# EAGLE design ZigUP (EAGLE 7.7.0)
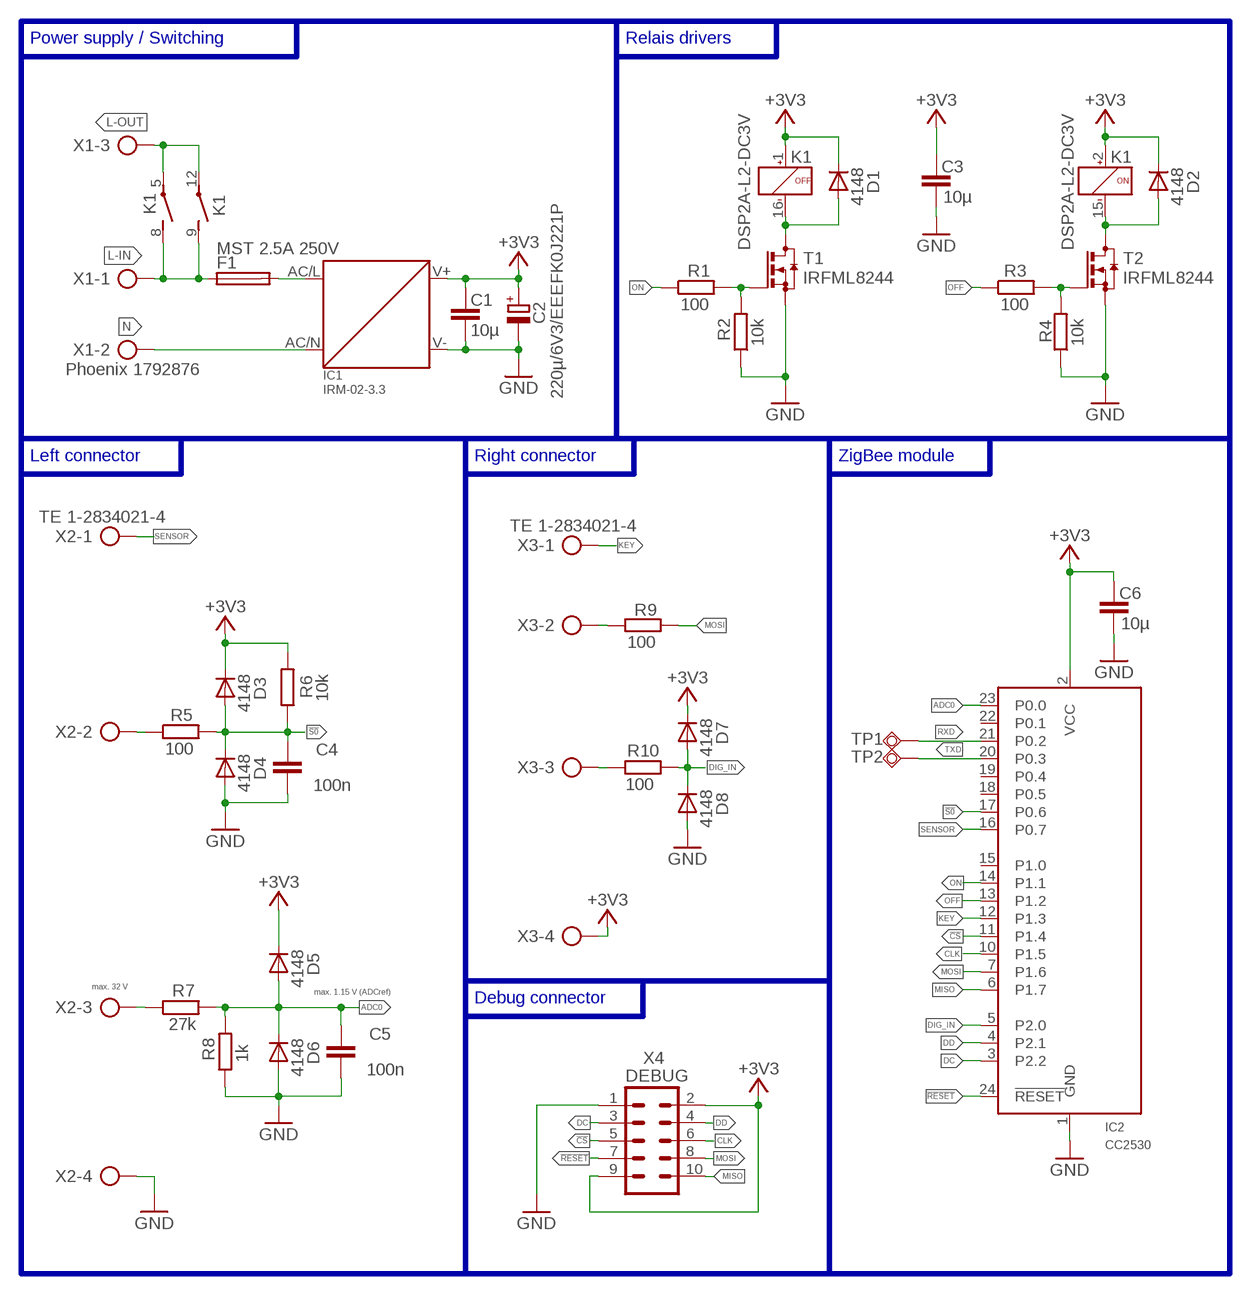
[diagram p0: schematic, sheet 1]

## Parts
C1  10µ  C-EUC0805  [C0805]
C2  220µ/6V3/EEEFK0J221P  CPOL-EUD  [PANASONIC_D]
C3  10µ  C-EUC0805  [C0805]
C4  100n  C-EUC0805  [C0805]
C5  100n  C-EUC0805  [C0805]
C6  10µ  C-EUC0805  [C0805]
D1  4148  TS4148  [1206]
D2  4148  TS4148  [1206]
D3  4148  TS4148  [1206]
D4  4148  TS4148  [1206]
D5  4148  TS4148  [1206]
D6  4148  TS4148  [1206]
D7  4148  TS4148  [1206]
D8  4148  TS4148  [1206]
F1  MST 2.5A 250V  MST  [MST]
IC1  IRM-02-3.3  IRM-01  [IRM-01]
IC2  CC2530  CC2530THT  [E18-MS1-PCB]
K1  DSP2A-L2-DC3V  DSP2A-L2  [DSP2A-L2]
R1  100  R-EU_R0805  [R0805]
R2  10k  R-EU_R0805  [R0805]
R3  100  R-EU_R0805  [R0805]
R4  10k  R-EU_R0805  [R0805]
R5  100  R-EU_R0805  [R0805]
R6  10k  R-EU_R0805  [R0805]
R7  27k  R-EU_R0805  [R0805]
R8  1k  R-EU_R0805  [R0805]
R9  100  R-EU_R0805  [R0805]
R10  100  R-EU_R0805  [R0805]
T1  IRFML8244  BSS123  [SOT23]
T2  IRFML8244  BSS123  [SOT23]
TP1  RX  TPSQTP15SQ  [TP15SQ]
TP2  TX  TPSQTP15SQ  [TP15SQ]
X1  Phoenix 1792876  PTS3  [PTS-3]
X2  TE 1-2834021-4  MSC4  [MSC4]
X3  TE 1-2834021-4  MSC4  [MSC4]
X4  DEBUG  MA05-2  [MA05-2]

## Nets
!CS: IC2.11(P1.4) X4.5
!RESET: IC2.24(!RESET) X4.7
!S0: C4.1 D3.A D4.K IC2.17(P0.6) R5.2 R6.1
+3V3: C1.1 C2.+ C3.1 C6.1 D1.K D2.K D3.K D5.K D7.K IC1.V+ IC2.2(VCC) K1.1(OFF:+) K1.2(ON:+) R6.2 X3.4 X4.2 X4.9
ADC0: C5.1 D5.A D6.K IC2.23(P0.0) R7.2 R8.2
CLK: IC2.10(P1.5) X4.6
DC: IC2.3(P2.2) X4.3
DD: IC2.4(P2.1) X4.4
DIG_IN: D7.A D8.K IC2.5(P2.0) R10.2
GND: C1.2 C2.- C3.2 C4.2 C5.2 C6.2 D4.A D6.A D8.A IC1.V- IC2.1(GND) R2.1 R4.1 R8.1 T1.2(S) T2.2(S) X2.4 X4.1
KEY: IC2.12(P1.3) X3.1
L-FUSED: F1.2 IC1.AC/L
L-IN: F1.1 K1.8(S1:C) K1.9(S2:C) X1.1
L-OUT: K1.5(S1:S) K1.12(S2:S) X1.3
MISO: IC2.6(P1.7) X4.10
MOSI: IC2.7(P1.6) R9.1 X4.8
N: IC1.AC/N X1.2
N$3: R7.1 X2.3
N$4: D2.A K1.15(ON:-) T2.3(D)
N$5: D1.A K1.16(OFF:-) T1.3(D)
N$6: R3.2 R4.2 T2.1(G)
N$7: R1.2 R2.2 T1.1(G)
N$8: R5.1 X2.2
N$10: R9.2 X3.2
N$12: R10.1 X3.3
OFF: IC2.13(P1.2) R3.1
ON: IC2.14(P1.1) R1.1
RXD: IC2.21(P0.2) TP1.TP
SENSOR: IC2.16(P0.7) X2.1
TXD: IC2.20(P0.3) TP2.TP
Unconnected: IC2.15(P1.0) IC2.18(P0.5) IC2.19(P0.4) IC2.22(P0.1)

## Buses
B$1

## Notes on the sheet
- Power supply / Switching | Relais drivers
- Left connector | Right connector | ZigBee module
- max. 32 V
- max. 1.15 V (ADCref)
- Debug connector

## Library data of the parts
C1 C3-C6 = rcl:C-EU: CAPACITOR, European symbol
C2 = rcl:CPOL-EU: POLARIZED CAPACITOR, European symbol
D1-D8 = Diode-1206:TS4148
F1 = Fuse_MST:MST
IC1 = IRM-01:IRM-01
IC2 = CC2530:CC2530
K1 = DSP2A-L2:DSP2A-L2
R1-R10 = rcl:R-EU_: RESISTOR, European symbol
T1 T2 = transistor-small-signal:BSS123: N-CHANNEL MOS FET
TP1 TP2 = testpad:TPSQ: Test pad
X1 = Phoenix_PTS_5mm:PTS
X2 X3 = TE-MSC:MSC
X4 = con-lstb:MA05-2: PIN HEADER; OC_FARNELL: unknown; OC_NEWARK: unknown

## Board
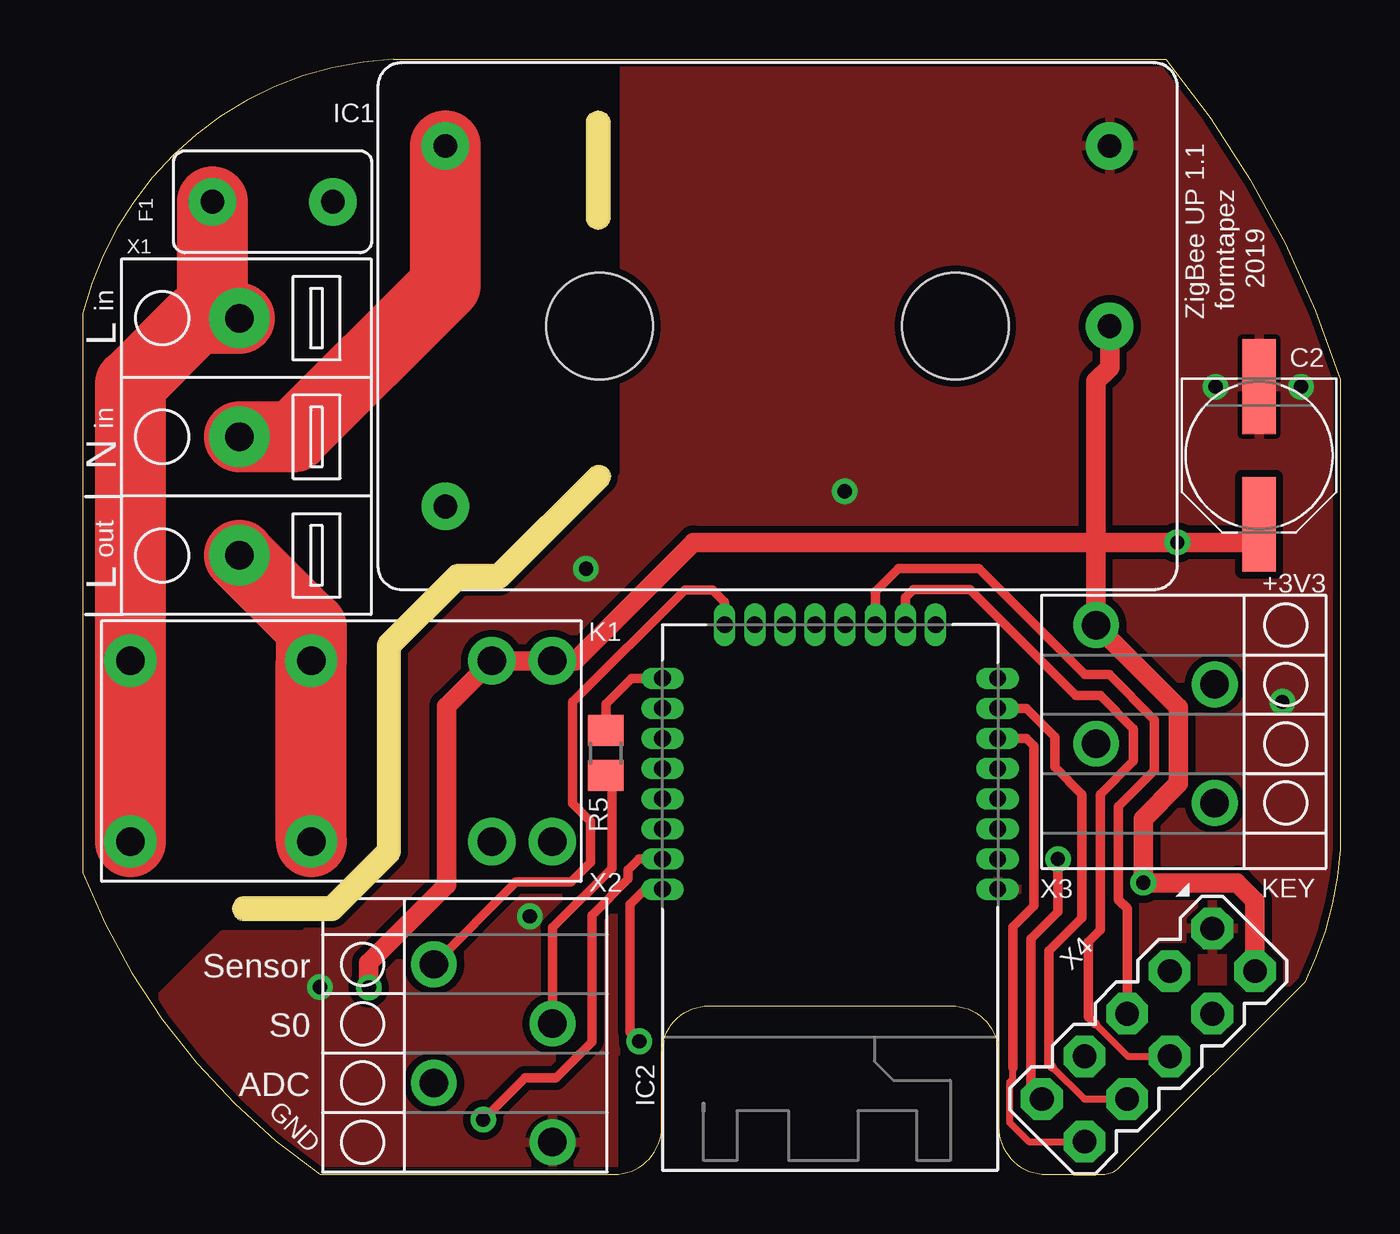
[diagram p1: board, top side]
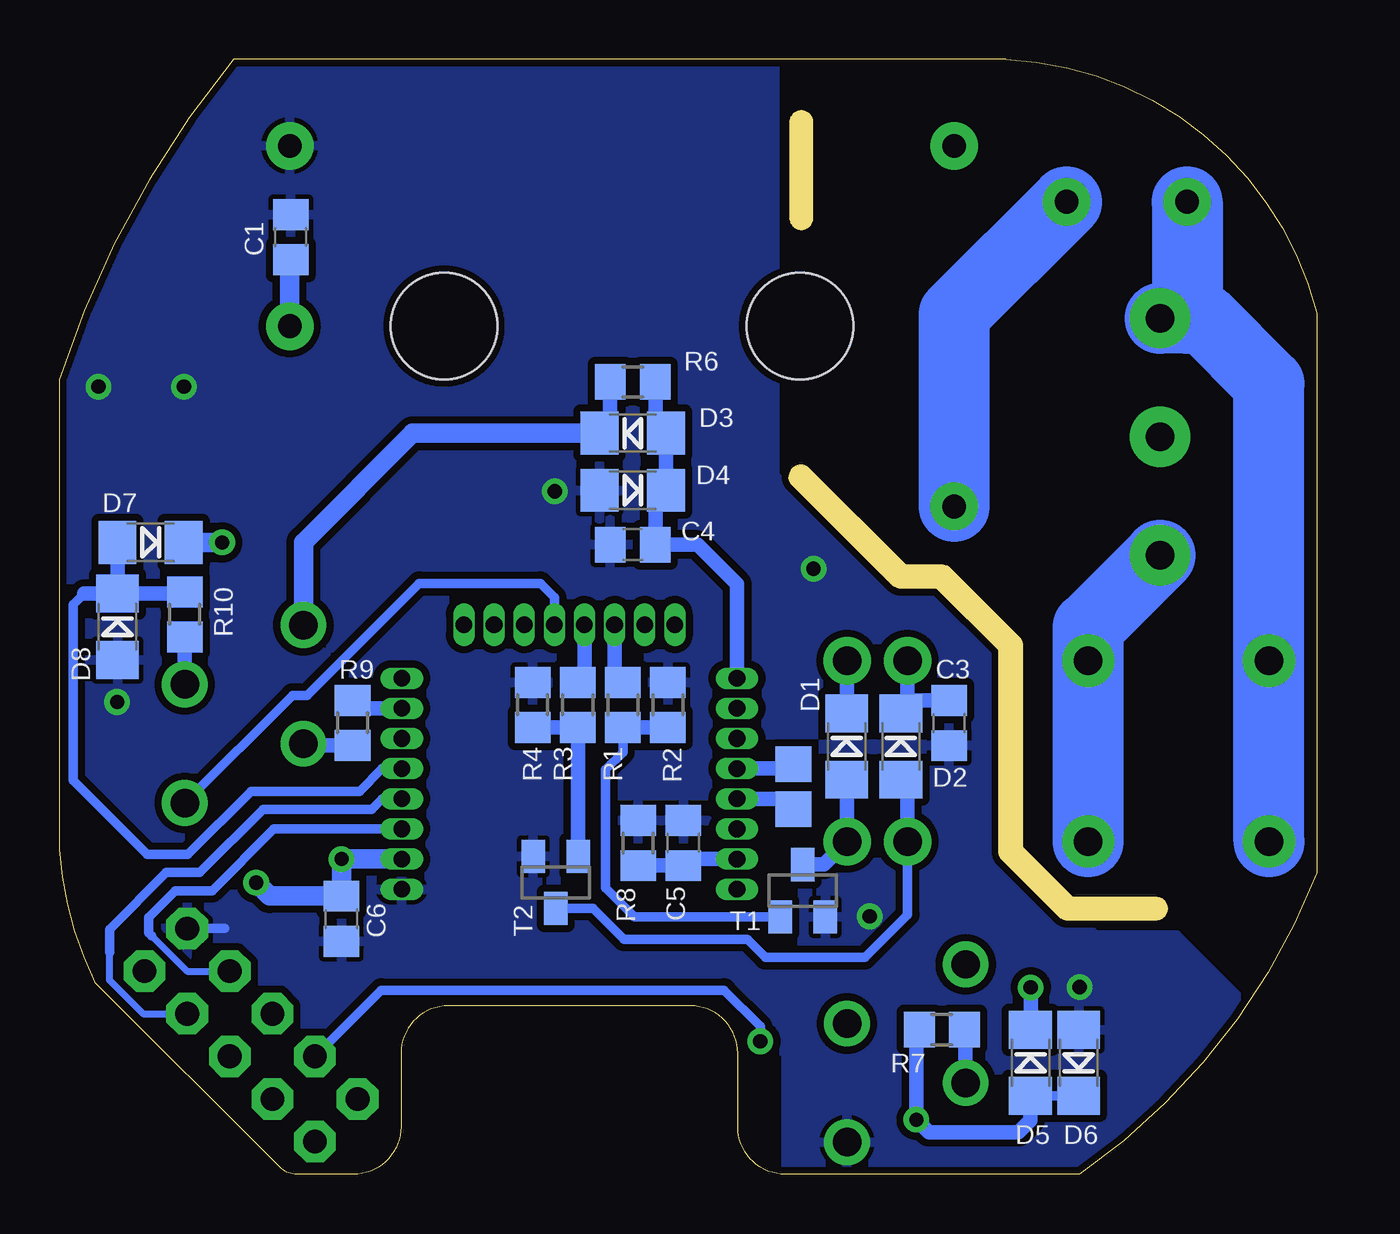
[diagram p2: board, bottom side, seen from below]

Size 53 x 47 mm. Coordinates in mm from the lower left corner, seen from the top.
Outline: 6.8,11.7 arc90 6.3,11.2 arc90 6.8,10.7 10.49,10.7 arc45 10.85,10.85 13.25,13.25 arc45 13.4,13.61 13.4,22.1 16,24.7 17.54,24.7 arc45 17.89,24.85 22.11,29.06 arc45 22.25,29.4 arc45 22.11,29.74 22.09,29.76 arc45 21.75,29.9 arc45 21.41,29.76 17.35,25.7 15.81,25.7 arc45 15.45,25.55 12.55,22.65 arc45 12.4,22.29 12.4,13.8 10.3,11.7 6.8,11.7
Outline: 10,0 22.4,0 arc90 24.4,2 24.4,5.1 arc-90 26.4,7.1 36.6,7.1 arc-90 38.6,5.1 38.6,2 arc90 40.6,0 42.99,0 arc45 43.69,0.29 51.5,8.1 arc23 53,13.7 53,33.5 arc22 45.65,47 13.1,47 arc73 0,36.3 0,12.7 arc34 10,0
Outline: 21.22,44.33 arc-90 21.72,44.83 arc-90 22.22,44.33 22.22,40.33 arc-90 21.72,39.83 arc-90 21.22,40.33 21.22,44.33
Copper layers (1*16): Top 0.035mm / dielectric 1.5mm / Bottom 0.035mm
Design rules "JLCPCB": minimum track width 5mil, minimum drill 0.3mm, track to track 5mil, track to pad 5mil, pad to pad 5mil, via to via 5mil, smd to smd 5mil, copper to edge 0.3mm, drill to drill 0.2mm, minimum pad ring 0.1mm, minimum via ring 0.15mm, stop-mask expansion 0.075mm, vias tented up to drill 0mil, thermal gap 0.2mm
Milling: 7 lines

### Footprints (pad centres in the part's own frame; a part is rotated, then mirrored left to right if it is on the bottom)
C0805 = smd 1.3 x 1.5: 1 -0.95,0; 2 0.95,0
PANASONIC_D = smd 4 x 1.4: + 2.9,0; - -2.9,0
1206 = smd 1.6 x 1.8: A -1.4,0; K 1.4,0
MST = drill 1 pad 2: 1 -2.54,0; 2 2.54,0
IRM-01 = drill 1 pad 2: AC/L -14,-7.6; AC/N -14,7.6; V+ 14,0; V- 14,7.6 | hole 4.5: -7.5,0; 7.5,0
E18-MS1-PCB = drill 0.7 pad 0.9 long: 1 -0.35,7.065; 2 -1.62,7.065; 3 -2.89,7.065; 4 -4.16,7.065; 5 -5.43,7.065; 6 -6.7,7.065; 7 -7.97,7.065; 8 -9.24,7.065; 9 -11.5,4.445; 10 -11.5,3.175; 11 -11.5,1.905; 12 -11.5,0.635; 13 -11.5,-0.635; 14 -11.5,-1.905; 15 -11.5,-3.175; 16 -11.5,-4.445; 17 -9.24,-7.065; 18 -7.97,-7.065; 19 -6.7,-7.065; 20 -5.43,-7.065; 21 -4.16,-7.065; 22 -2.89,-7.065; 23 -1.62,-7.065; 24 -0.35,-7.065
DSP2A-L2 = drill 1.2 pad 2: 1 -8.89,-3.81; 2 -6.35,-3.81; 15 -6.35,3.81; 16 -8.89,3.81 | drill 1.2 pad 2.2: 5 1.27,-3.81; 8 8.89,-3.81; 9 8.89,3.81; 12 1.27,3.81
R0805 = smd 1.3 x 1.5: 1 -0.95,0; 2 0.95,0
SOT23 = smd 1 x 1.4: 1 -0.95,-1.1; 2 0.95,-1.1; 3 0,1.1
TP15SQ = smd 1.5 x 1.5: TP 0,0
PTS-3 = drill 1.2 pad 2.54: 1 -5,0; 2 0,0; 3 5,0
MSC4 = drill 1.2 pad 1.93: 1 -3.75,-2.5; 2 -1.25,2.5; 3 1.25,-2.5; 4 3.75,2.5
MA05-2 = drill 1 pad 1.75 octagon: 1 -5.08,-1.27; 2 -5.08,1.27; 3 -2.54,-1.27; 4 -2.54,1.27; 5 0,-1.27; 6 0,1.27; 7 2.54,-1.27; 8 2.54,1.27; 9 5.08,-1.27; 10 5.08,1.27

### Placement (x,y rotation side)
C1  43.25,39.5 90 bottom
C2  49.58,30.3 270 top
C3  15.5,19.02 270 bottom
C4  28.83,26.54 180 bottom
C5  26.7,13.96 90 bottom
C6  41.1,10.78 270 bottom
D1  19.81,18.03 90 bottom
D2  17.53,18.03 90 bottom
D3  28.83,31.24 180 bottom
D4  28.83,28.83 0 bottom
D5  12.06,4.7 90 bottom
D6  10.03,4.7 270 bottom
D7  49.15,26.64 0 bottom
D8  50.55,23.08 90 bottom
F1  8,41 0 top
IC1  29.29,35.75 0 top
IC2  31.5,11.67 270 top
K1  10.9,17.84 180 top
R1  29.25,19.79 270 bottom
R2  27.35,19.79 270 bottom
R3  31.15,19.79 270 bottom
R4  33.05,19.79 270 bottom
R5  22.05,17.76 90 top
R6  28.83,33.4 180 bottom
R7  15.8,6.1 180 bottom
R8  28.6,13.96 270 bottom
R9  40.64,19.03 270 bottom
R10  47.71,23.6 90 bottom
T1  21.66,11.95 0 bottom
T2  32.08,12.3 180 bottom
TP1  22.05,15.38 0 bottom
TP2  22.05,17.29 0 bottom
X1  6.6,31.09 270 top
X2  17.3,5.1 270 top
X3  45.21,19.4 90 top
X4  44.92,5.87 225 top

### Tracks (layer width: path | path; a pad name or v marks a point on that pad's centre or on a via)
!CS
  Top 0.406: X4.5 44.02,11.2 43.65,11.57 43.65,15.51 45.17,17.03 45.17,19.16 43.26,21.06 42.25,21.06 37.77,25.54 34.37,25.54 33.41,24.57 IC2.11
!RESET  (via drill 0.6)
  Top 0.406: v23.45,5.6 23.07,5.99 23.07,11.39 23.7,12.02 IC2.24
  Bottom 0.406: X4.7 39.43,7.76 24.98,7.76 23.45,6.24 v23.45,5.6
!S0
  Top 0.406: IC2.17 23.14,20.91 22.05,19.82 R5.2
  Bottom 0.406: D4.K 27.88,28.38 | 27.88,31.69 D3.A
  Bottom 0.61: IC2.17 24.43,24.88 26.1,26.54 C4.1 27.88,28.38 | R6.1 27.88,31.69 | D3.A D4.K
+3V3  (via drill 0.6)
  Top 0.406: X4.9 39.96,3.64 39.96,9.92 41.1,11.06 v41.1,13.29
  Top 0.813: X4.2 49.41,11.53 48.64,12.29 v44.7,12.29 44.7,14.98 46.19,16.47 46.19,19.68 X3.4 42.71,26.67 | v12.05,7.88 12.05,8.92 15.33,12.19 15.33,19.73 K1.2 K1.1 20.76,21.65 25.75,26.64 42.64,26.64 42.67,26.67 42.76,26.67 42.8,26.64 | 42.8,26.64 v46.14,26.64 49.58,26.64 C2.+ | 42.8,26.64 42.75,26.64 42.71,26.67 | 42.71,26.67 42.71,33.44 43.29,34.02 IC1.V+
  Bottom 0.406: 19.79,19.46 D1.K | 17.25,19.71 D2.K | 29.78,31.69 D3.K | D5.K
  Bottom 0.61: K1.1 19.79,19.46 | K1.2 17.25,19.71 16.99,19.97 C3.1 | R6.2 29.78,31.69 | v12.05,7.88 D5.K
  Bottom 0.813: X3.4 42.71,26.64 38.1,31.24 D3.K | IC2.2 v41.1,13.29 C6.1 44.14,11.73 v44.7,12.29 | D7.K v46.14,26.64 | IC1.V+ 43.29,38.51 C1.1
ADC0  (via drill 0.6)
  Top 0.406: v16.88,2.3 18.64,4.06 19.94,4.06 21.46,5.59 21.46,10.92 22.99,12.45 22.99,12.83 23.45,13.29 IC2.23
  Bottom 0.406: 26.68,13.04 C5.1 26.42,13.29 | D6.K D5.A
  Bottom 0.61: C5.1 R8.2 | IC2.23 26.42,13.29 | D5.A 12.06,2.29 12.57,1.78 16.35,1.78 v16.88,2.3 16.88,5.97 R7.2
CLK
  Top 0.305: 42.68,6.34 44.05,4.97 X4.6
  Top 0.406: 42.68,6.34 42.38,6.64 42.38,9.79 42.88,10.3 42.88,16.02 44.28,17.41 44.28,18.78 42.88,20.17 41.87,20.17 37.39,24.65 35.01,24.65 34.67,24.32 IC2.10
DC
  Bottom 0.305: 49.11,10.05 47.62,8.56 X4.3
  Bottom 0.406: 49.11,10.05 49.23,10.18 49.23,10.84 48.12,11.95 46.57,11.95 43.96,14.56 IC2.3
DD
  Bottom 0.305: X4.4 49.47,6.77 50.88,8.18 50.88,9.36
  Bottom 0.406: IC2.4 39.39,15.83 39.84,15.38 44.41,15.38 47.07,12.72 48.5,12.72 50.88,10.33 50.88,9.36
DIG_IN
  Bottom 0.406: IC2.5 39.39,17.1 40.34,16.14 44.91,16.14 47.58,13.48 49.29,13.48 52.41,16.6 52.41,24.01 51.94,24.48 | D8.K
  Bottom 0.61: 51.94,24.48 D8.K 47.78,24.48 R10.2 | D8.K D7.A
GND  (via drill 0.6)
  Bottom 0.406: X4.1 46.03,10.36
  other vias: 32.11,28.79 50.56,19.91 9.99,7.89 47.75,33.2 51.35,33.2 21.21,25.53 18.85,10.87
  pour Bottom (isolate 0.305): 22.36,5.2 22.36,-0.06 10.03,-0.13 7.37,2.03 5.21,4.19 3.43,6.48 2.99,7.2 3,7.2 5.9,10.1 9.3,10.1 12.9,13.6 12.9,22.3 15.8,25.2 18.56,25.2 22.83,29.46 22.83,46.99 45.59,46.99 47.37,44.83 49.28,41.91 50.93,38.86 52.32,35.43 53.09,33.53 53.1,13.5 52.5,10.3 51.5,8.1 48.7,5.2
  pour Top (isolate 0.305): 22.36,5.2 22.36,-0.06 10.03,-0.13 7.37,2.03 5.21,4.19 3.43,6.48 2.99,7.2 3,7.2 5.9,10.1 9.3,10.1 12.9,13.6 12.9,22.3 15.8,25.2 18.56,25.2 22.83,29.46 22.83,46.99 45.59,46.99 47.37,44.83 49.28,41.91 50.93,38.86 52.32,35.43 53.09,33.53 53.09,13.99 53.1,13.9 52.9,12.3 52.5,10.4 51.5,8.1 48.7,5.2
KEY
  Bottom 0.406: IC2.12 32.13,24.32 32.72,24.91 37.83,24.91 42.55,20.19 43.17,20.19 X3.1
L-FUSED
  Bottom 3: F1.2 15.29,36.25 IC1.AC/L
L-IN
  Top 2: X1.1 6.6,36.19
  Top 3: K1.9 K1.8 2.01,33.31 4.78,36.09 X1.1 5.46,36.09 F1.1
  Bottom 2: X1.1 6.6,36.19
  Bottom 3: K1.9 2.01,33.31 4.78,36.09 5.46,36.09 | F1.1 5.46,36.09 | 5.46,36.09 X1.1
L-OUT
  Top 3: K1.12 K1.5 9.63,23.06 X1.3
  Bottom 3: K1.12 9.63,23.06 X1.3
MISO
  Top 0.305: X4.10 39.87,1.38 39.07,2.17 39.07,3.89 39.2,4.02 39.2,4.49
  Top 0.406: IC2.6 39.77,18.37 40.09,18.05 40.09,11.32 39.2,10.43 39.2,4.49
MOSI
  Top 0.305: 40.85,4.54 42.21,3.17 X4.8
  Top 0.406: 40.85,4.54 40.72,4.66 40.72,9.41 42.12,10.81 42.12,16.02 40.98,17.16 40.98,18.43 39.77,19.64 IC2.7
  Bottom 0.61: IC2.7 40.3,19.64 R9.1
N
  Top 3: X1.2 8.89,31.09 15.29,37.49 IC1.AC/N
N$3
  Bottom 0.406: 14.8,6.05 R7.1
  Bottom 0.61: X2.3 14.8,6.05
N$4
  Bottom 0.406: 17.25,16.36 D2.A | K1.15 17.25,10.94 19.05,9.14 23.24,9.14 24,9.91 29.21,9.91 30.5,11.21 T2.3
  Bottom 0.61: K1.15 17.25,16.36
N$5
  Bottom 0.406: 19.79,16.61 D1.A
  Bottom 0.61: 19.79,16.61 K1.16 20.76,13.05 T1.3
N$6
  Bottom 0.406: 31.13,18.82 R3.2
  Bottom 0.61: R4.2 R3.2 | T2.1 31.13,18.82
N$7
  Bottom 0.406: R1.2 29.25,17.79 29.97,17.06 29.97,12.07 28.76,10.85 T1.1
  Bottom 0.61: R1.2 R2.2
N$8
  Top 0.406: R5.1 22.3,16.55 22.3,12.9 19.8,10.4 X2.2
N$10
  Bottom 0.61: R9.2 42.64,18.08 X3.2
N$12
  Bottom 0.61: X3.3 R10.1
OFF
  Bottom 0.61: IC2.13 30.86,21.02 R3.1
ON
  Bottom 0.61: IC2.14 29.59,21.09 R1.1
RXD
  Bottom 0.61: IC2.21 22.5,15.83 TP1.TP
SENSOR
  Top 0.406: IC2.16 27.05,24.13 26.54,24.64 25.37,24.64 20.65,19.91 20.65,15.64 21.4,14.88 21.4,13.14 20.57,12.32 18.27,12.32 X2.1
TXD
  Bottom 0.61: IC2.20 22.24,17.1 TP2.TP

### Text on the board
tPlace: ZigBee UP 1.1 | formtapez | 2019 | in | L | in | N | out | L | +3V3 | KEY | Sensor | S0 | ADC | GND
tValues: 2.5A | 220µ
tDocu: DIG | LED